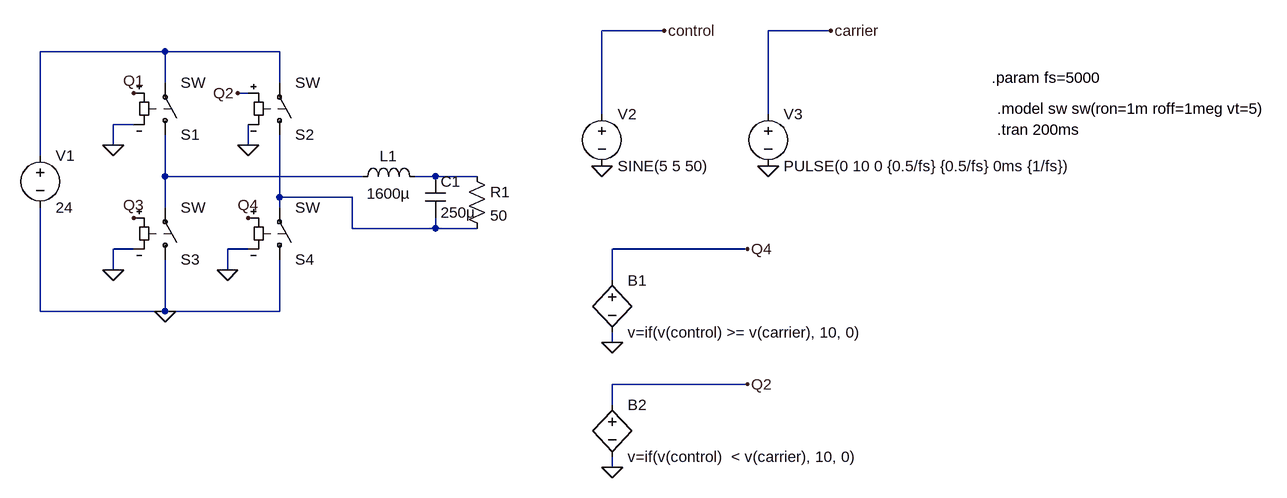
[diagram p0: schematic hbridge.asc]
hbridge.asc, the LTspice schematic file:
Version 4
SHEET 1 1924 680
WIRE 944 -32 848 -32
WIRE 1200 -32 1104 -32
WIRE 176 0 -16 0
WIRE 352 0 176 0
WIRE 176 48 176 0
WIRE 352 48 352 0
WIRE 304 64 288 64
WIRE 848 96 848 -32
WIRE 1104 96 1104 -32
WIRE 128 112 96 112
WIRE 96 144 96 112
WIRE 304 144 304 112
WIRE -16 160 -16 0
WIRE 176 192 176 128
WIRE 480 192 176 192
WIRE 592 192 560 192
WIRE 656 192 592 192
WIRE 352 224 352 128
WIRE 464 224 352 224
WIRE 176 240 176 192
WIRE 352 240 352 224
WIRE 464 272 464 224
WIRE 592 272 592 256
WIRE 592 272 464 272
WIRE 656 272 592 272
WIRE 128 304 96 304
WIRE 304 304 272 304
WIRE 1072 304 864 304
WIRE 96 336 96 304
WIRE 272 336 272 304
WIRE 864 352 864 304
WIRE -16 400 -16 240
WIRE 176 400 176 320
WIRE 176 400 -16 400
WIRE 352 400 352 320
WIRE 352 400 176 400
WIRE 864 448 864 432
WIRE 1072 512 864 512
WIRE 864 544 864 512
WIRE 864 640 864 624
FLAG 96 144 0
FLAG 96 336 0
FLAG 272 336 0
FLAG 304 144 0
FLAG 176 400 0
FLAG 128 64 Q1
FLAG 288 64 Q2
FLAG 128 256 Q3
FLAG 304 256 Q4
FLAG 848 176 0
FLAG 1104 176 0
FLAG 944 -32 control
FLAG 1200 -32 carrier
FLAG 864 448 0
FLAG 864 640 0
FLAG 1072 304 Q4
FLAG 1072 512 Q2
SYMBOL sw 176 144 M180
SYMATTR InstName S1
SYMBOL sw 352 144 M180
SYMATTR InstName S2
SYMBOL sw 176 336 M180
SYMATTR InstName S3
SYMBOL sw 352 336 M180
SYMATTR InstName S4
SYMBOL voltage -16 144 R0
WINDOW 123 0 0 Left 0
WINDOW 39 0 0 Left 0
SYMATTR InstName V1
SYMATTR Value 24
SYMBOL ind 464 208 R270
WINDOW 0 32 56 VTop 2
WINDOW 3 5 56 VBottom 2
SYMATTR InstName L1
SYMATTR Value 1600µ
SYMBOL res 640 176 R0
SYMATTR InstName R1
SYMATTR Value 50
SYMBOL cap 576 192 R0
SYMATTR InstName C1
SYMATTR Value 250µ
SYMBOL voltage 848 80 R0
WINDOW 123 0 0 Left 0
WINDOW 39 0 0 Left 0
SYMATTR InstName V2
SYMATTR Value SINE(5 5 50)
SYMBOL voltage 1104 80 R0
WINDOW 123 0 0 Left 0
WINDOW 39 0 0 Left 0
SYMATTR InstName V3
SYMATTR Value PULSE(0 10 0 {0.5/fs} {0.5/fs} 0ms {1/fs})
SYMBOL bv 864 336 R0
SYMATTR InstName B1
SYMATTR Value v=if(v(control) >= v(carrier), 10, 0)
SYMBOL bv 864 528 R0
SYMATTR InstName B2
SYMATTR Value v=if(v(control)  < v(carrier), 10, 0)
TEXT 1448 40 Left 2 !.param fs=5000
TEXT 1456 88 Left 2 !.model sw sw(ron=1m roff=1meg vt=5)
TEXT 1456 120 Left 2 !.tran 200ms

The netlist it stands for:
* hbridge.asc
S1 N002 N001 Q1 0 SW
S2 N004 N001 Q2 0 SW
S3 0 N002 Q3 0 SW
S4 0 N004 Q4 0 SW
V1 N001 0 24
L1 N002 N003 1600µ
R1 N003 N004 50
C1 N003 N004 250µ
V2 control 0 SINE(5 5 50)
V3 carrier 0 PULSE(0 10 0 {0.5/fs} {0.5/fs} 0ms {1/fs})
B1 Q4 0 v=if(v(control) >= v(carrier), 10, 0)
B2 Q2 0 v=if(v(control)  < v(carrier), 10, 0)
.param fs=5000
.model sw sw(ron=1m roff=1meg vt=5)
.tran 200ms
.backanno
.end